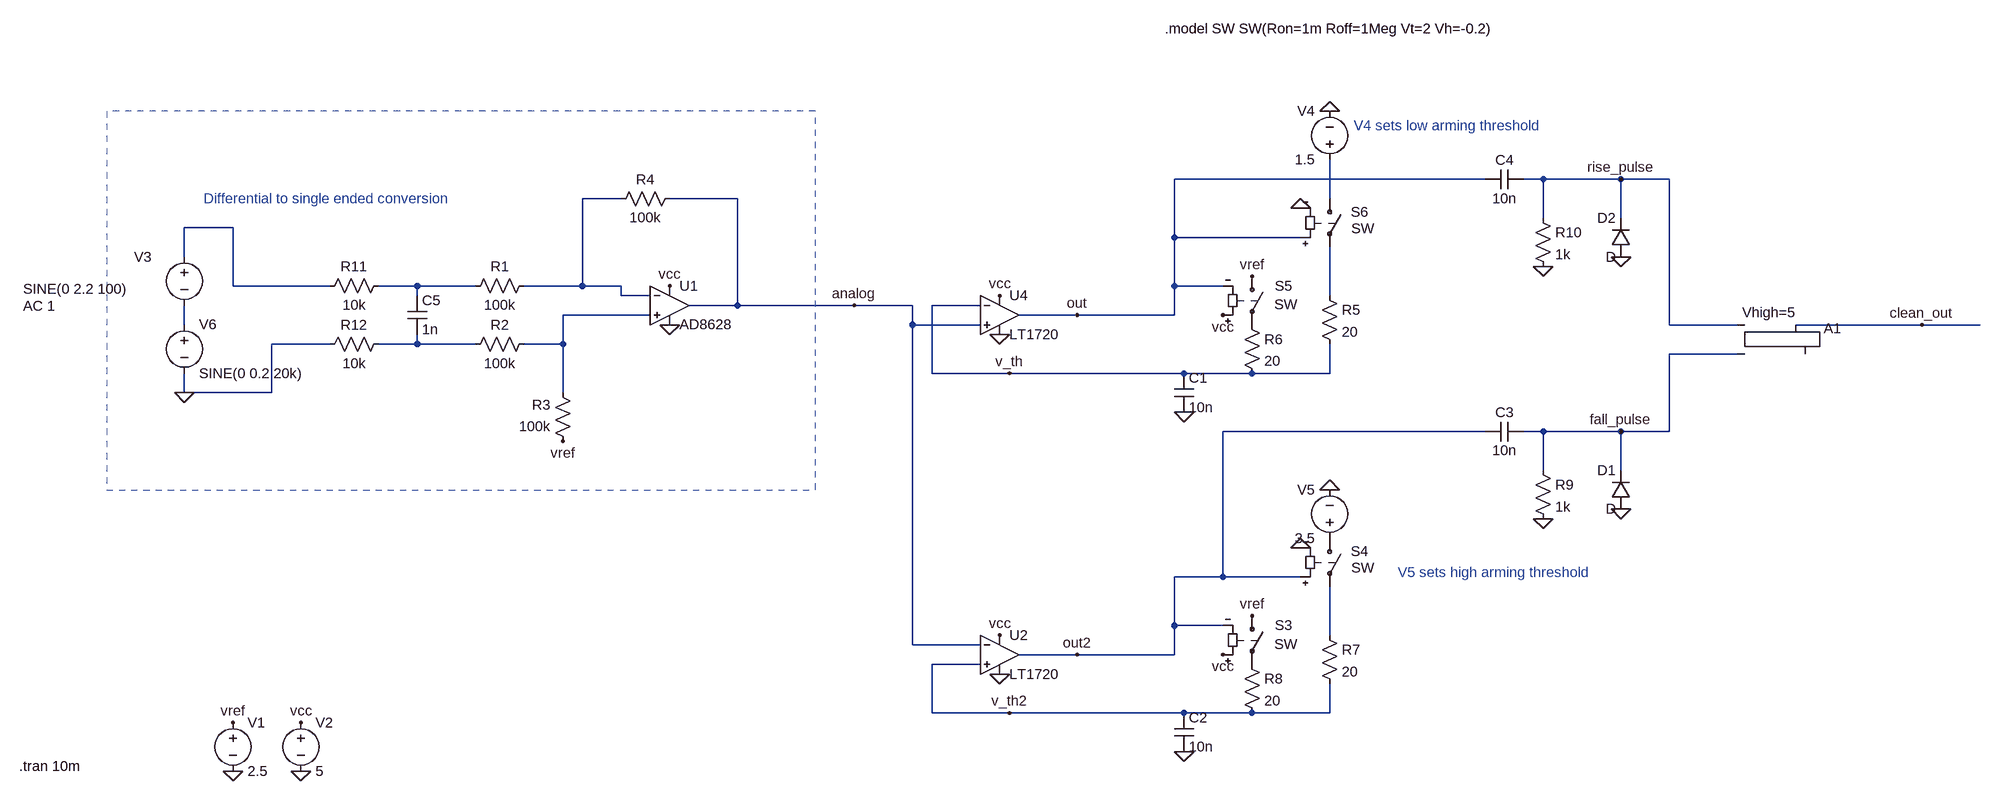
[diagram p0: schematic VR_Thresholded.asc]
VR_Thresholded.asc, the LTspice schematic file:
Version 4
SHEET 1 2708 968
WIRE 1616 -128 1104 -128
WIRE 1712 -128 1680 -128
WIRE 1840 -128 1712 -128
WIRE 1920 -128 1840 -128
WIRE 192 -96 128 -96
WIRE 384 -96 272 -96
WIRE 1360 -96 1360 -160
WIRE 1712 -64 1712 -128
WIRE 1840 -64 1840 -128
WIRE -448 -48 -528 -48
WIRE 1104 -32 1104 -128
WIRE 1312 -32 1104 -32
WIRE -528 0 -528 -48
WIRE -448 48 -448 -48
WIRE -288 48 -448 48
WIRE -144 48 -208 48
WIRE -48 48 -144 48
WIRE 128 48 128 -96
WIRE 128 48 32 48
WIRE 192 48 128 48
WIRE 1104 48 1104 -32
WIRE 1184 48 1104 48
WIRE -144 64 -144 48
WIRE 192 64 192 48
WIRE 240 64 192 64
WIRE 1360 64 1360 -16
WIRE 384 80 384 -96
WIRE 384 80 304 80
WIRE 576 80 384 80
WIRE 672 80 576 80
WIRE 784 80 704 80
WIRE 240 96 96 96
WIRE 944 96 848 96
WIRE 1104 96 1104 48
WIRE 1104 96 944 96
WIRE -528 112 -528 80
WIRE 672 112 672 80
WIRE 784 112 672 112
WIRE 1920 112 1920 -128
WIRE 2032 112 1920 112
WIRE 2336 112 2128 112
WIRE 2432 112 2336 112
WIRE -288 144 -384 144
WIRE -144 144 -144 128
WIRE -144 144 -208 144
WIRE -48 144 -144 144
WIRE 96 144 96 96
WIRE 96 144 32 144
WIRE 2032 160 1920 160
WIRE 704 192 704 80
WIRE 832 192 704 192
WIRE 1120 192 832 192
WIRE 1232 192 1120 192
WIRE 1360 192 1360 144
WIRE 1360 192 1232 192
WIRE -528 224 -528 192
WIRE -384 224 -384 144
WIRE -384 224 -528 224
WIRE 96 224 96 144
WIRE 1616 288 1184 288
WIRE 1712 288 1680 288
WIRE 1840 288 1712 288
WIRE 1920 288 1920 160
WIRE 1920 288 1840 288
WIRE 1712 352 1712 288
WIRE 1840 352 1840 288
WIRE 1184 528 1184 288
WIRE 1184 528 1104 528
WIRE 1312 528 1184 528
WIRE 1104 608 1104 528
WIRE 1184 608 1104 608
WIRE 1360 624 1360 544
WIRE 672 640 672 112
WIRE 784 640 672 640
WIRE 944 656 848 656
WIRE 1104 656 1104 608
WIRE 1104 656 944 656
WIRE 784 672 704 672
WIRE 704 752 704 672
WIRE 832 752 704 752
WIRE 1120 752 832 752
WIRE 1232 752 1120 752
WIRE 1360 752 1360 704
WIRE 1360 752 1232 752
FLAG 272 112 0
FLAG 272 48 vcc
FLAG 96 304 vref
FLAG -448 768 vref
FLAG -336 768 vcc
FLAG -448 848 0
FLAG -336 848 0
FLAG 816 128 0
FLAG 816 64 vcc
FLAG 944 96 out
FLAG 1120 256 0
FLAG 1360 -240 0
FLAG 832 192 v_th
FLAG 816 688 0
FLAG 816 624 vcc
FLAG 944 656 out2
FLAG 1120 816 0
FLAG 832 752 v_th2
FLAG 2336 112 clean_out
FLAG 1232 32 vref
FLAG 1360 384 0
FLAG 1232 592 vref
FLAG 1312 480 0
FLAG 1184 656 vcc
FLAG 1312 -80 0
FLAG 1184 96 vcc
FLAG 1840 416 0
FLAG 1712 432 0
FLAG 1840 0 0
FLAG 1712 16 0
FLAG 1840 -128 rise_pulse
FLAG 1840 288 fall_pulse
FLAG -528 224 0
FLAG 576 80 analog
SYMBOL Opamps\\AD8628 272 16 R0
SYMATTR InstName U1
SYMBOL res 48 32 R90
WINDOW 0 0 56 VBottom 2
WINDOW 3 32 56 VTop 2
SYMATTR InstName R1
SYMATTR Value 100k
SYMBOL res 48 128 R90
WINDOW 0 0 56 VBottom 2
WINDOW 3 32 56 VTop 2
SYMATTR InstName R2
SYMATTR Value 100k
SYMBOL res 112 320 R180
WINDOW 0 36 76 Left 2
WINDOW 3 36 40 Left 2
SYMATTR InstName R3
SYMATTR Value 100k
SYMBOL res 176 -80 R270
WINDOW 0 32 56 VTop 2
WINDOW 3 0 56 VBottom 2
SYMATTR InstName R4
SYMATTR Value 100k
SYMBOL voltage -448 752 R0
WINDOW 123 0 0 Left 0
WINDOW 39 0 0 Left 0
SYMATTR InstName V1
SYMATTR Value 2.5
SYMBOL voltage -336 752 R0
WINDOW 123 0 0 Left 0
WINDOW 39 0 0 Left 0
SYMATTR InstName V2
SYMATTR Value 5
SYMBOL voltage -528 -16 R0
WINDOW 0 -83 16 Left 2
WINDOW 3 -266 69 Left 2
WINDOW 123 -266 97 Left 2
WINDOW 39 0 0 Left 0
SYMATTR InstName V3
SYMATTR Value SINE(0 2.2 100)
SYMATTR Value2 AC 1
SYMBOL res 1344 48 R0
SYMATTR InstName R5
SYMATTR Value 20
SYMBOL res 1216 96 R0
SYMATTR InstName R6
SYMATTR Value 20
SYMBOL cap 1104 192 R0
SYMATTR InstName C1
SYMATTR Value 10n
SYMBOL voltage 1360 -144 R180
WINDOW 0 24 96 Left 2
WINDOW 3 24 16 Left 2
WINDOW 123 0 0 Left 0
WINDOW 39 0 0 Left 0
SYMATTR InstName V4
SYMATTR Value 1.5
SYMBOL sw 1232 576 R0
WINDOW 0 38 32 Left 2
WINDOW 3 37 63 Left 2
SYMATTR InstName S3
SYMBOL sw 1360 448 R0
WINDOW 0 35 38 Left 2
WINDOW 3 36 65 Left 2
SYMATTR InstName S4
SYMBOL res 1344 608 R0
SYMATTR InstName R7
SYMATTR Value 20
SYMBOL res 1216 656 R0
SYMATTR InstName R8
SYMATTR Value 20
SYMBOL cap 1104 752 R0
SYMATTR InstName C2
SYMATTR Value 10n
SYMBOL voltage 1360 480 R180
WINDOW 0 24 96 Left 2
WINDOW 3 24 16 Left 2
WINDOW 123 0 0 Left 0
WINDOW 39 0 0 Left 0
SYMATTR InstName V5
SYMATTR Value 3.5
SYMBOL voltage -528 96 R0
WINDOW 123 0 0 Left 0
WINDOW 39 0 0 Left 0
SYMATTR InstName V6
SYMATTR Value SINE(0 0.2 20k)
SYMBOL Digital\\srflop 2080 64 R0
WINDOW 3 -40 28 Left 2
SYMATTR Value Vhigh=5
SYMATTR InstName A1
SYMBOL sw 1232 16 R0
WINDOW 0 38 32 Left 2
WINDOW 3 37 63 Left 2
SYMATTR InstName S5
SYMBOL sw 1360 -112 R0
WINDOW 0 35 38 Left 2
WINDOW 3 36 65 Left 2
SYMATTR InstName S6
SYMBOL res 1696 336 R0
SYMATTR InstName R9
SYMATTR Value 1k
SYMBOL cap 1680 272 R90
WINDOW 0 0 32 VBottom 2
WINDOW 3 32 32 VTop 2
SYMATTR InstName C3
SYMATTR Value 10n
SYMBOL diode 1856 416 R180
WINDOW 0 24 64 Left 2
WINDOW 3 24 0 Left 2
SYMATTR InstName D1
SYMBOL res 1696 -80 R0
SYMATTR InstName R10
SYMATTR Value 1k
SYMBOL cap 1680 -144 R90
WINDOW 0 0 32 VBottom 2
WINDOW 3 32 32 VTop 2
SYMATTR InstName C4
SYMATTR Value 10n
SYMBOL diode 1856 0 R180
WINDOW 0 24 64 Left 2
WINDOW 3 24 0 Left 2
SYMATTR InstName D2
SYMBOL Comparators\\LT1720 816 32 R0
SYMATTR InstName U4
SYMBOL Comparators\\LT1720 816 592 R0
SYMATTR InstName U2
SYMBOL res -192 32 R90
WINDOW 0 0 56 VBottom 2
WINDOW 3 32 56 VTop 2
SYMATTR InstName R11
SYMATTR Value 10k
SYMBOL res -192 128 R90
WINDOW 0 0 56 VBottom 2
WINDOW 3 32 56 VTop 2
SYMATTR InstName R12
SYMATTR Value 10k
SYMBOL cap -160 64 R0
SYMATTR InstName C5
SYMATTR Value 1n
TEXT 1088 -376 Left 2 !.model SW SW(Ron=1m Roff=1Meg Vt=2 Vh=-0.2)
TEXT -496 -96 Left 2 ;Differential to single ended conversion
TEXT -800 840 Left 2 !.tran 10m
TEXT 1472 520 Left 2 ;V5 sets high arming threshold
TEXT 1400 -216 Left 2 ;V4 sets low arming threshold
RECTANGLE Normal 512 -240 -656 384 2

The netlist it stands for:
* VR_Thresholded.asc
XU1 N006 N001 vcc 0 analog AD8628  ; pins In+ In- V+ V- OUT
R1 N001 N004 100k
R2 N006 N008 100k
R3 vref N006 100k
R4 N001 analog 100k
V1 vref 0 2.5
V2 vcc 0 5
V3 N003 N007 SINE(0 2.2 100) AC 1
R5 N005 v_th 20
R6 P001 v_th 20
C1 v_th 0 10n
V4 N002 0 1.5
S3 vref P002 vcc out2 SW
S4 P003 N009 out2 0 SW
R7 N009 v_th2 20
R8 P002 v_th2 20
C2 v_th2 0 10n
V5 P003 0 3.5
V6 N007 0 SINE(0 0.2 20k)
A1 rise_pulse fall_pulse 0 0 0 0 clean_out 0 SRFLOP Vhigh=5
S5 vref P001 vcc out SW
S6 N002 N005 out 0 SW
R9 fall_pulse 0 1k
C3 fall_pulse out2 10n
D1 0 fall_pulse D
R10 rise_pulse 0 1k
C4 rise_pulse out 10n
D2 0 rise_pulse D
XU4 analog v_th vcc 0 out LT1720  ; pins In+ In- V+ V- OUT
XU2 v_th2 analog vcc 0 out2 LT1720  ; pins In+ In- V+ V- OUT
R11 N004 N003 10k
R12 N008 0 10k
C5 N004 N008 1n
.model D D
.lib standard.dio
.model SW SW(Ron=1m Roff=1Meg Vt=2 Vh=-0.2)
* Differential to single ended conversion
.tran 10m
* V5 sets high arming threshold
* V4 sets low arming threshold
.lib LT1720.sub
.backanno
.end